# Altium project Switching_Circuit.PrjPcb
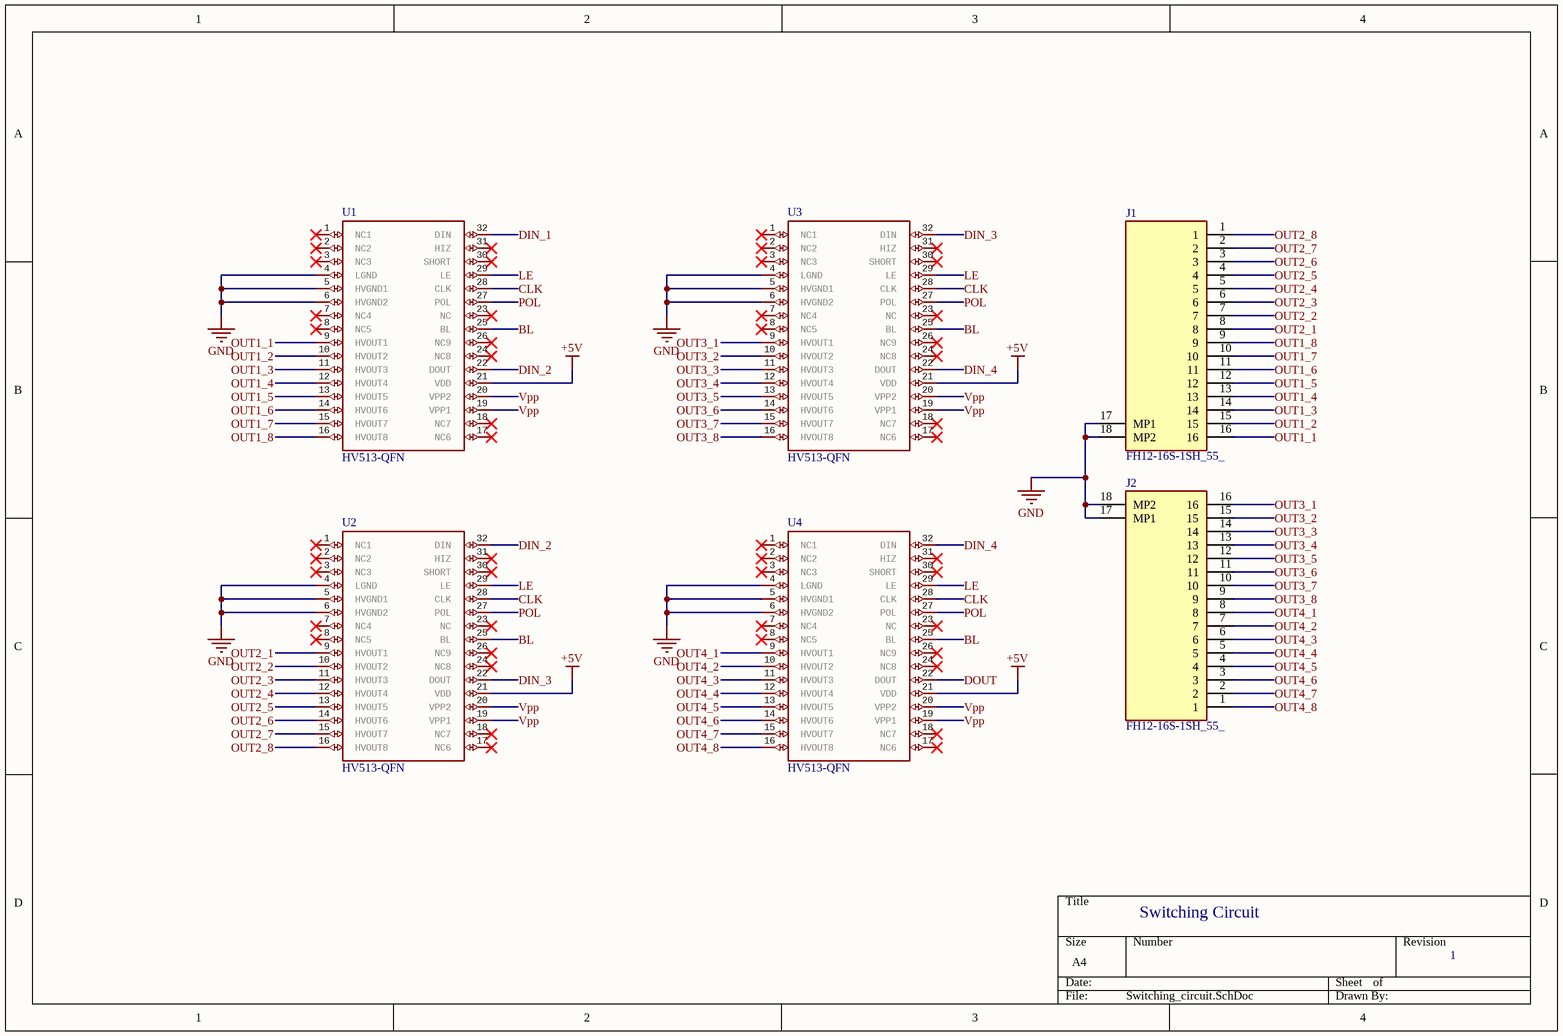
[diagram p0: Switching_circuit.SchDoc]
2 sheets, 11 parts. Net scope: global (net labels, ports and power ports of the same name join across sheets).
Board file: switch_board.PcbDoc
Sheets:
  Switching_circuit.SchDoc
  connectors.SchDoc

## Sheet Switching_circuit.SchDoc
size A4; SheetNumber: 1; SheetTotal: 2

### Parts
J1  FH12-16S-1SH_55_  [FH1216S1SH55]
J2  FH12-16S-1SH_55_  [FH1216S1SH55]
U1  HV513-QFN  [HV513-QFN]
U2  HV513-QFN  [HV513-QFN]
U3  HV513-QFN  [HV513-QFN]
U4  HV513-QFN  [HV513-QFN]

### Nets
+5V: U1.21(VDD) U2.21(VDD) U3.21(VDD) U4.21(VDD)
GND: J1.17(MP1) J1.18(MP2) J2.17(MP1) J2.18(MP2) U1.4(LGND) U1.5(HVGND1) U1.6(HVGND2) U2.4(LGND) U2.5(HVGND1) U2.6(HVGND2) U3.4(LGND) U3.5(HVGND1) U3.6(HVGND2) U4.4(LGND) U4.5(HVGND1) U4.6(HVGND2)
BL: U1.25(BL) U2.25(BL) U3.25(BL) U4.25(BL)
CLK: U1.28(CLK) U2.28(CLK) U3.28(CLK) U4.28(CLK)
DIN_1: U1.32(DIN)
DIN_2: U1.22(DOUT) U2.32(DIN)
DIN_3: U2.22(DOUT) U3.32(DIN)
DIN_4: U3.22(DOUT) U4.32(DIN)
DOUT: U4.22(DOUT)
LE: U1.29(LE) U2.29(LE) U3.29(LE) U4.29(LE)
OUT1_1: J1.16 U1.9(HVOUT1)
OUT1_2: J1.15 U1.10(HVOUT2)
OUT1_3: J1.14 U1.11(HVOUT3)
OUT1_4: J1.13 U1.12(HVOUT4)
OUT1_5: J1.12 U1.13(HVOUT5)
OUT1_6: J1.11 U1.14(HVOUT6)
OUT1_7: J1.10 U1.15(HVOUT7)
OUT1_8: J1.9 U1.16(HVOUT8)
OUT2_1: J1.8 U2.9(HVOUT1)
OUT2_2: J1.7 U2.10(HVOUT2)
OUT2_3: J1.6 U2.11(HVOUT3)
OUT2_4: J1.5 U2.12(HVOUT4)
OUT2_5: J1.4 U2.13(HVOUT5)
OUT2_6: J1.3 U2.14(HVOUT6)
OUT2_7: J1.2 U2.15(HVOUT7)
OUT2_8: J1.1 U2.16(HVOUT8)
OUT3_1: J2.16 U3.9(HVOUT1)
OUT3_2: J2.15 U3.10(HVOUT2)
OUT3_3: J2.14 U3.11(HVOUT3)
OUT3_4: J2.13 U3.12(HVOUT4)
OUT3_5: J2.12 U3.13(HVOUT5)
OUT3_6: J2.11 U3.14(HVOUT6)
OUT3_7: J2.10 U3.15(HVOUT7)
OUT3_8: J2.9 U3.16(HVOUT8)
OUT4_1: J2.8 U4.9(HVOUT1)
OUT4_2: J2.7 U4.10(HVOUT2)
OUT4_3: J2.6 U4.11(HVOUT3)
OUT4_4: J2.5 U4.12(HVOUT4)
OUT4_5: J2.4 U4.13(HVOUT5)
OUT4_6: J2.3 U4.14(HVOUT6)
OUT4_7: J2.2 U4.15(HVOUT7)
OUT4_8: J2.1 U4.16(HVOUT8)
POL: U1.27(POL) U2.27(POL) U3.27(POL) U4.27(POL)
Vpp: U1.19(VPP1) U1.20(VPP2) U2.19(VPP1) U2.20(VPP2) U3.19(VPP1) U3.20(VPP2) U4.19(VPP1) U4.20(VPP2)

Not connected (* = marked no-connect by the designer): U1 1(NC1)* 2(NC2)* 3(NC3)* 7(NC4)* 8(NC5)* 17(NC6)* 18(NC7)* 23(NC)* 24(NC8)* 26(NC9)* 30(SHORT)* 31(HIZ)*; U2 1(NC1)* 2(NC2)* 3(NC3)* 7(NC4)* 8(NC5)* 17(NC6)* 18(NC7)* 23(NC)* 24(NC8)* 26(NC9)* 30(SHORT)* 31(HIZ)*; U3 1(NC1)* 2(NC2)* 3(NC3)* 7(NC4)* 8(NC5)* 17(NC6)* 18(NC7)* 23(NC)* 24(NC8)* 26(NC9)* 30(SHORT)* 31(HIZ)*; U4 1(NC1)* 2(NC2)* 3(NC3)* 7(NC4)* 8(NC5)* 17(NC6)* 18(NC7)* 23(NC)* 24(NC8)* 26(NC9)* 30(SHORT)* 31(HIZ)*

### Notes on the sheet
- Switching Circuit
- 1

### Library data of the parts
J1 J2 = FH12-16S-1SH_55_: Connector; Manufacturer_Name: Hirose; Manufacturer_Part_Number: FH12-16S-1SH(55); Datasheet Link: https://www.hirose.com/en/product/document?clcode=CL0586-0536-8-55&productname=FH12-16S-1SH(55)&series=FH12&documenttype=2DDrawing&lang=en&documentid=0000987749; Height: 2.2mm; Mouser Part Number: 798-FH12-16S-1SH55; Mouser Price/Stock: https://www.mouser.co.uk/ProductDetail/Hirose-Connector/FH12-16S-1SH55?qs=Ux3WWAnHpjBc3pYMMfcXYg%3D%3D; Arrow Part Number: FH12-16S-1SH(55); Arrow Price/Stock: https://www.arrow.com/en/products/fh12-16s-1sh-55/hirose-electric

## Sheet connectors.SchDoc
size A4; SheetNumber: 2; SheetTotal: 2
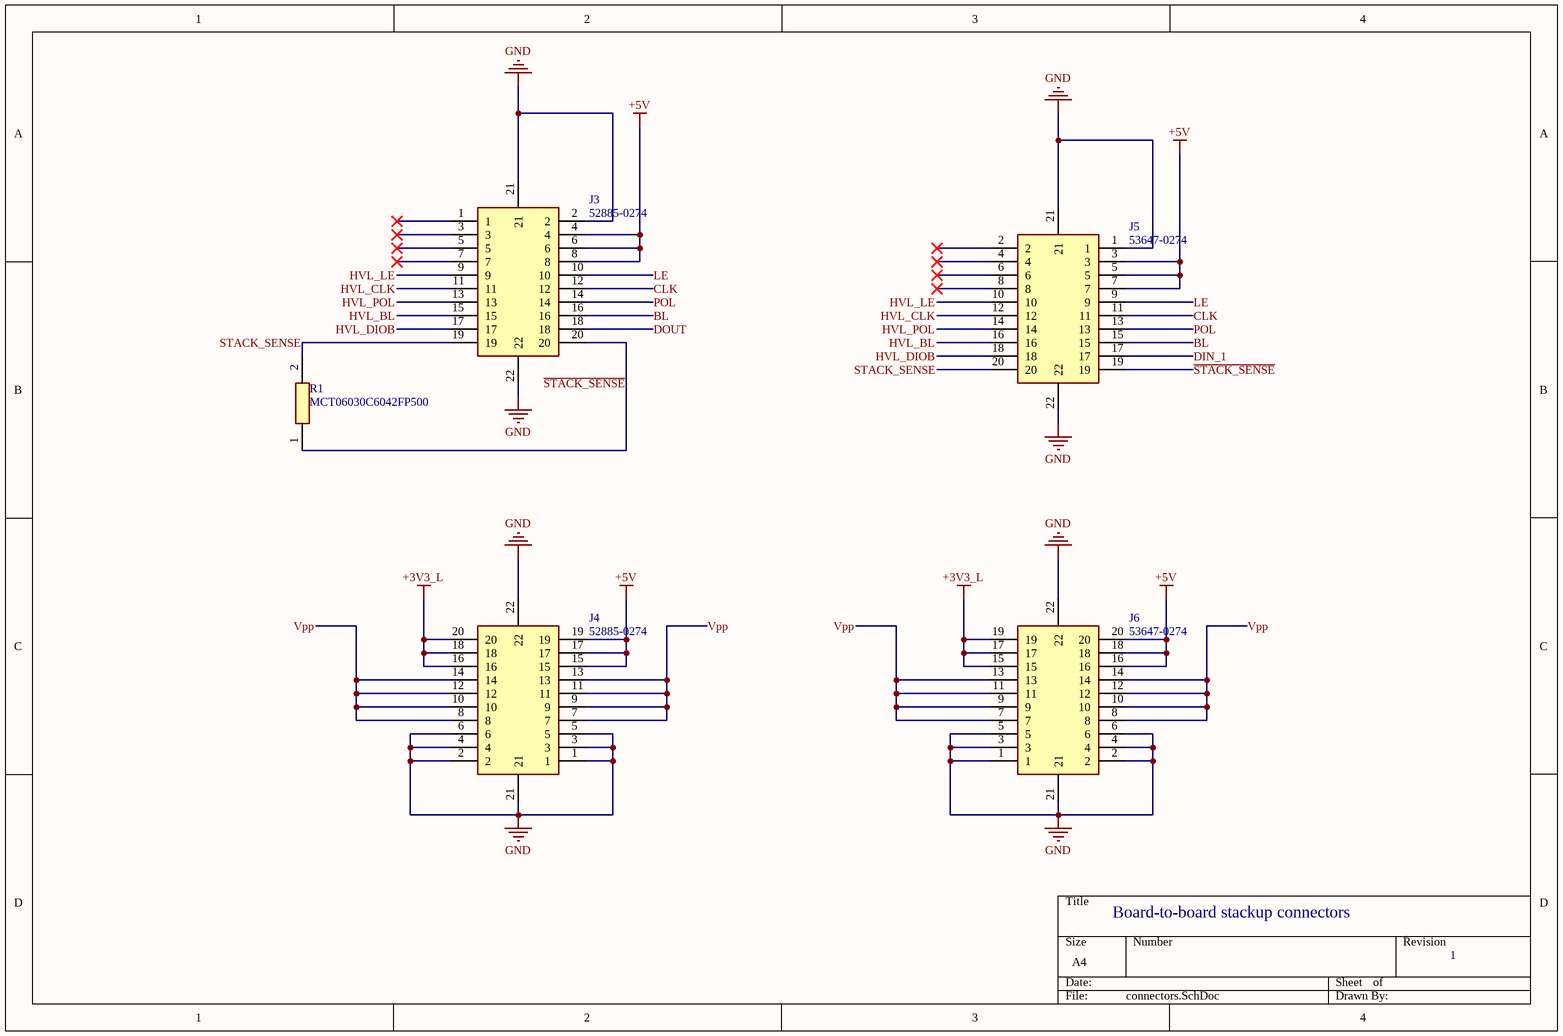
[diagram p1: connectors.SchDoc]

### Parts
J3  52885-0274  [528850274]
J4  52885-0274  [528850274]
J5  53647-0274  [536470274]
J6  53647-0274  [536470274]
R1  MCT06030C6042FP500  [RESC1608X55N]

### Nets
+3V3_L: J4.16 J4.18 J4.20 J6.15 J6.17 J6.19
+5V: J3.4 J3.6 J3.8 J4.15 J4.17 J4.19 J5.3 J5.5 J5.7 J6.16 J6.18 J6.20
GND: J3.2 J3.21 J3.22 J4.1 J4.2 J4.3 J4.4 J4.5 J4.6 J4.21 J4.22 J5.1 J5.21 J5.22 J6.1 J6.2 J6.3 J6.4 J6.5 J6.6 J6.21 J6.22
~{STACK_SENSE}: J3.20 J5.19 R1.1
BL: J3.16 J5.15
CLK: J3.12 J5.11
DIN_1: J5.17
DOUT: J3.18
HVL_BL: J3.15 J5.16
HVL_CLK: J3.11 J5.12
HVL_DIOB: J3.17 J5.18
HVL_LE: J3.9 J5.10
HVL_POL: J3.13 J5.14
LE: J3.10 J5.9
POL: J3.14 J5.13
STACK_SENSE: J3.19 J5.20 R1.2
Vpp: J4.7 J4.8 J4.9 J4.10 J4.11 J4.12 J4.13 J4.14 J6.7 J6.8 J6.9 J6.10 J6.11 J6.12 J6.13 J6.14

Not connected (* = marked no-connect by the designer): J3 1* 3* 5* 7*; J5 2* 4* 6* 8*

### Notes on the sheet
- Board-to-board stackup connectors
- 1

### Library data of the parts
J3 J4 = 52885-0274: Connector; Manufacturer_Name: Molex; Datasheet Link: https://www.molex.com/webdocs/datasheets/pdf/en-us/0528850274_PCB_RECEPTACLES.pdf; Height: 4mm; Manufacturer_Part_Number: 52885-0274; Mouser Part Number: 538-52885-0274; Mouser Price/Stock: https://www.mouser.co.uk/ProductDetail/Molex/52885-0274?qs=%252BPJ3Ll1xQNYiQig4hWY5jQ%3D%3D
J5 J6 = 53647-0274: Connector; Manufacturer_Name: Molex; Datasheet Link: https://www.molex.com/pdm_docs/sd/536470274_sd.pdf; Height: 7mm; Manufacturer_Part_Number: 53647-0274; Mouser Part Number: 538-53647-0274; Mouser Price/Stock: https://www.mouser.co.uk/ProductDetail/Molex/53647-0274?qs=8nk6kXN3TSGT9To7JpUGHA%3D%3D
R1 = MCT06030C6042FP500: Resistor; Manufacturer_Name: Vishay; Datasheet Link: http://www.vishay.com/docs/28705/mcx0x0xpro.pdf; Height: 0.55mm; Manufacturer_Part_Number: MCT06030C6042FP500

## Nets that join several sheets
+5V: Switching_circuit (U1.21 U2.21 U3.21 U4.21), connectors (12 pins)
GND: Switching_circuit (16 pins), connectors (22 pins)
BL: Switching_circuit (U1.25 U2.25 U3.25 U4.25), connectors (J3.16 J5.15)
CLK: Switching_circuit (U1.28 U2.28 U3.28 U4.28), connectors (J3.12 J5.11)
DIN_1: Switching_circuit (U1.32), connectors (J5.17)
DOUT: Switching_circuit (U4.22), connectors (J3.18)
LE: Switching_circuit (U1.29 U2.29 U3.29 U4.29), connectors (J3.10 J5.9)
POL: Switching_circuit (U1.27 U2.27 U3.27 U4.27), connectors (J3.14 J5.13)
Vpp: Switching_circuit (8 pins), connectors (16 pins)